# Altium schematic sheet MCU.SchDoc
size 406 x 304 mm; SheetNumber: 11; SheetTotal: 14
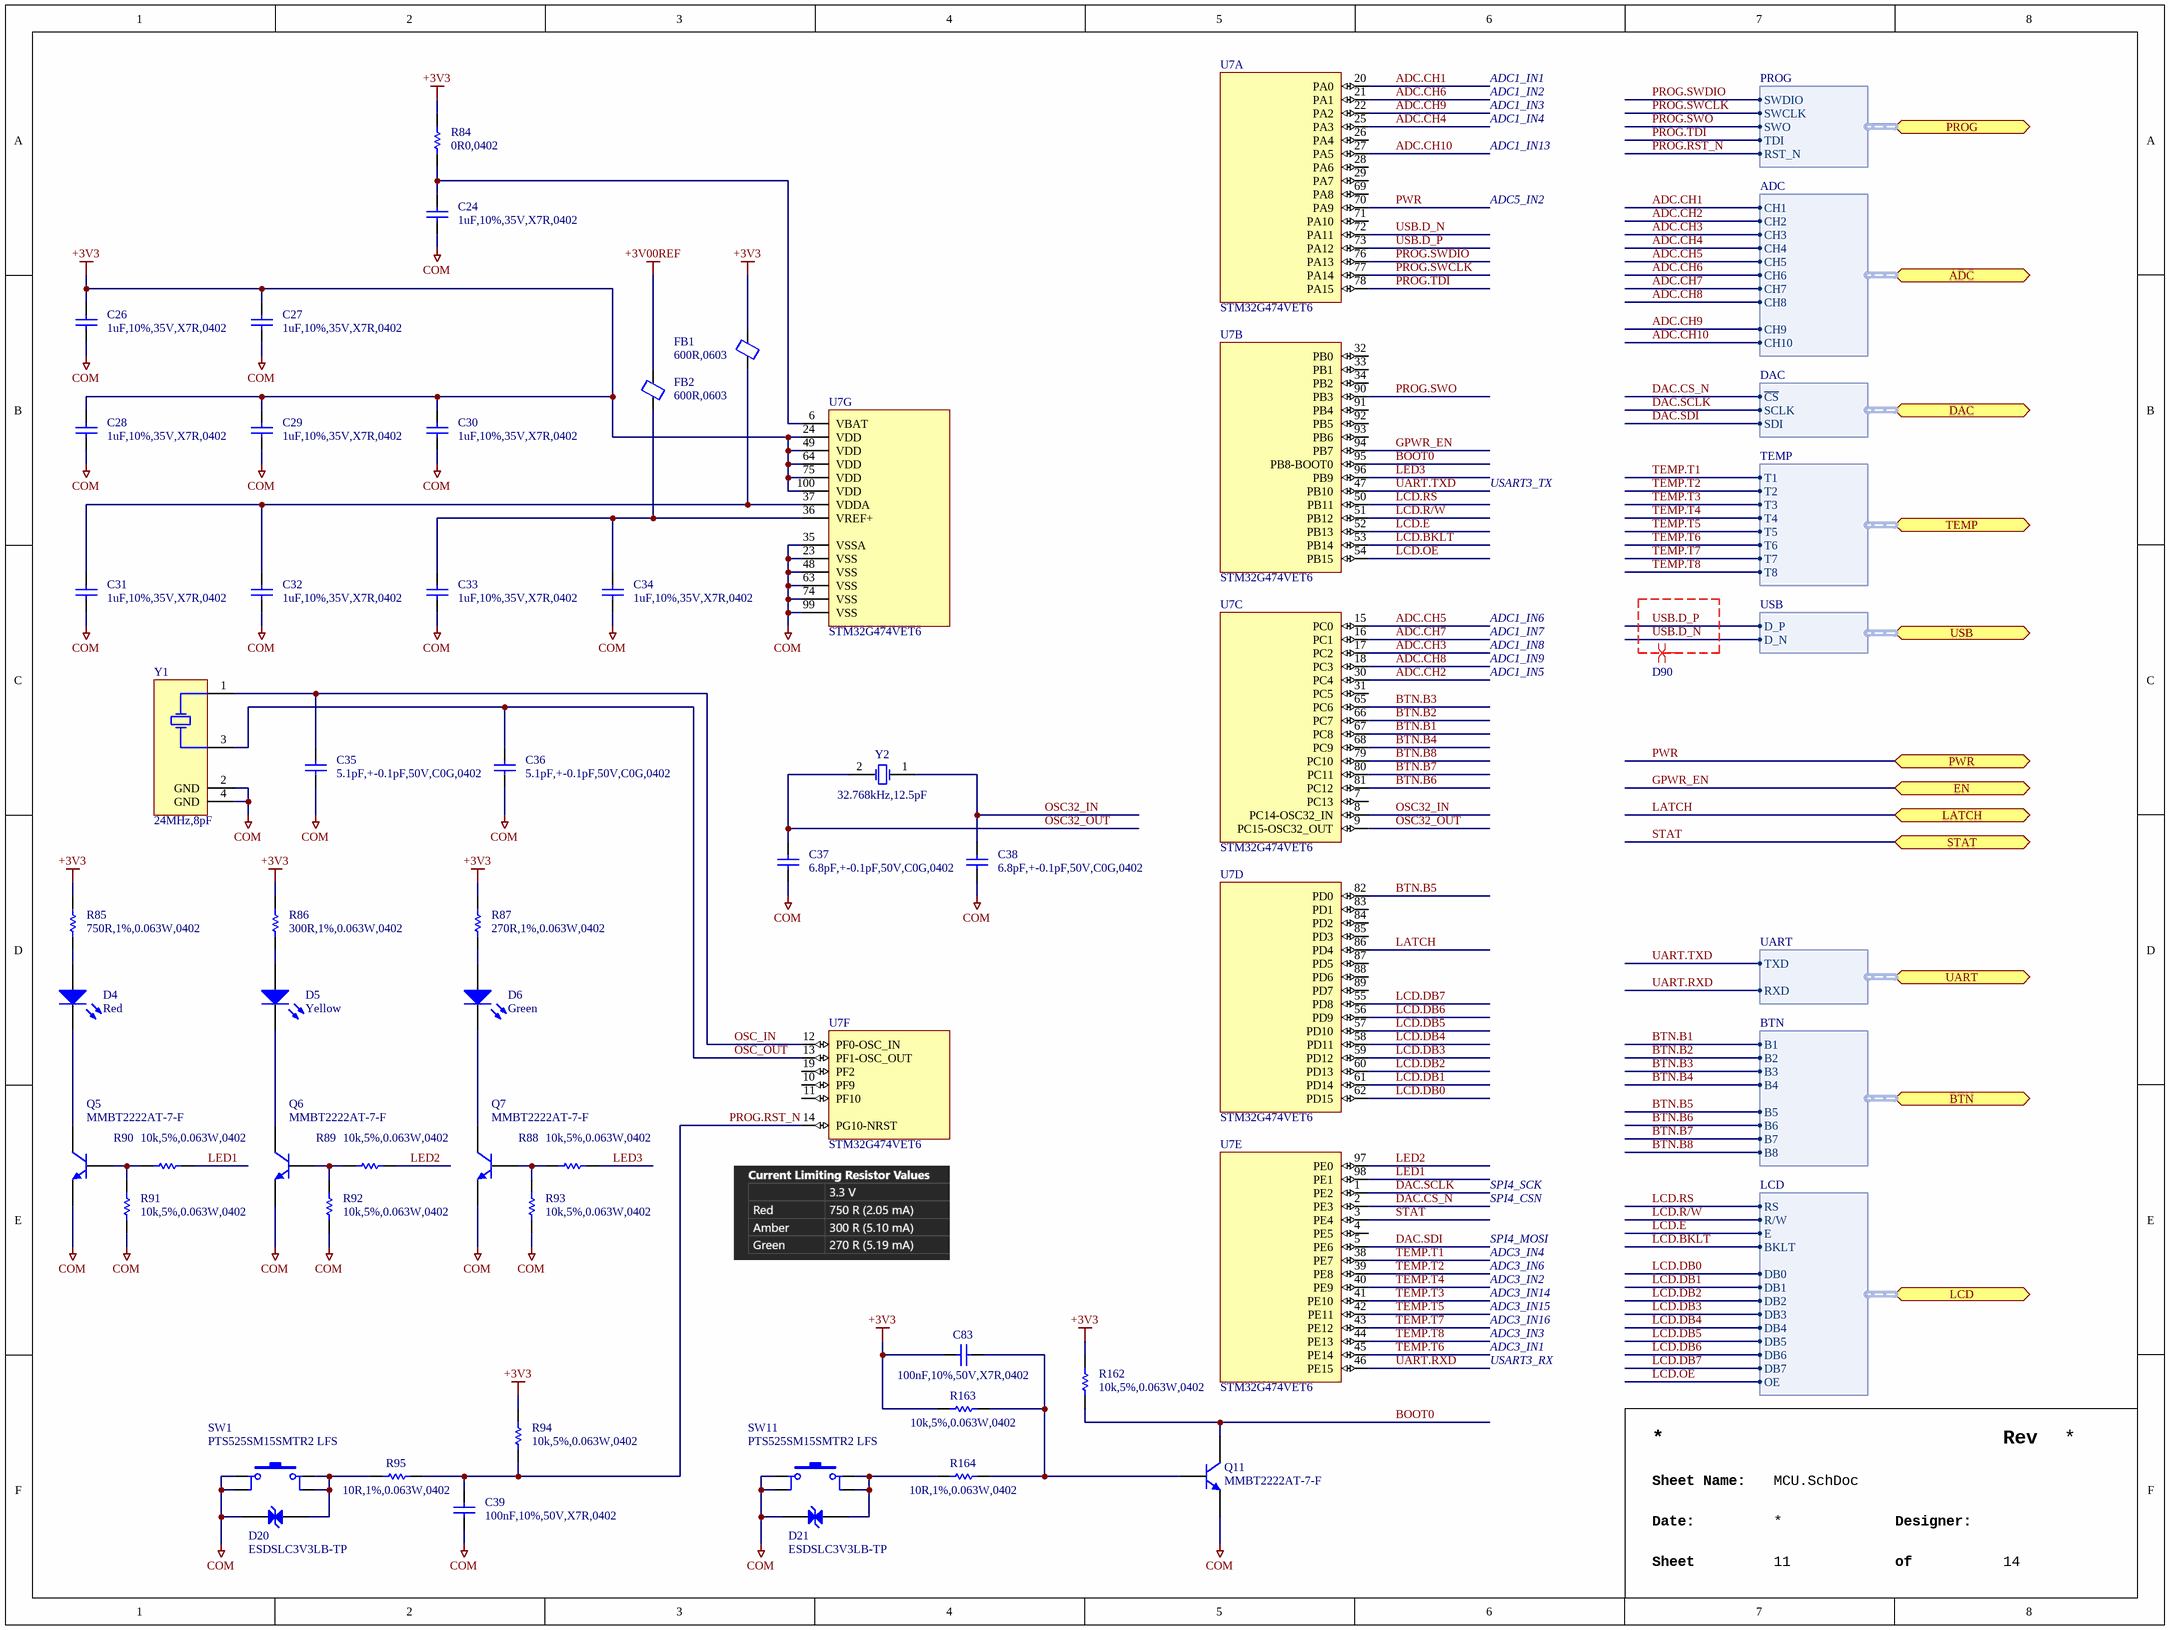
[diagram p0: MCU.SchDoc]

## Parts
C24  1uF,10%,35V,X7R,0402  [CAPC1005X06N]
C26  1uF,10%,35V,X7R,0402  [CAPC1005X06N]
C27  1uF,10%,35V,X7R,0402  [CAPC1005X06N]
C28  1uF,10%,35V,X7R,0402  [CAPC1005X06N]
C29  1uF,10%,35V,X7R,0402  [CAPC1005X06N]
C30  1uF,10%,35V,X7R,0402  [CAPC1005X06N]
C31  1uF,10%,35V,X7R,0402  [CAPC1005X06N]
C32  1uF,10%,35V,X7R,0402  [CAPC1005X06N]
C33  1uF,10%,35V,X7R,0402  [CAPC1005X06N]
C34  1uF,10%,35V,X7R,0402  [CAPC1005X06N]
C35  5.1pF,+-0.1pF,50V,C0G,0402  [CAPC1005X06N]
C36  5.1pF,+-0.1pF,50V,C0G,0402  [CAPC1005X06N]
C37  6.8pF,+-0.1pF,50V,C0G,0402  [CAPC1005X06N]
C38  6.8pF,+-0.1pF,50V,C0G,0402  [CAPC1005X06N]
C39  100nF,10%,50V,X7R,0402  [CAPC1005X06N]
C83  100nF,10%,50V,X7R,0402  [CAPC1005X06N]
D4  Red  [LITE-ON_LTST-C190KRKT]
D5  Yellow  [LITE-ON_LTST-C190KSKT]
D6  Green  [LITE-ON_LTST-C190KGKT]
D20  ESDSLC3V3LB-TP  [DFN65P100X50-2N]
D21  ESDSLC3V3LB-TP  [DFN65P100X50-2N]
FB1  600R,0603  [INDC_0603]
FB2  600R,0603  [INDC_0603]
Q5  MMBT2222AT-7-F  [SOTFL50P160X90-3N]
Q6  MMBT2222AT-7-F  [SOTFL50P160X90-3N]
Q7  MMBT2222AT-7-F  [SOTFL50P160X90-3N]
Q11  MMBT2222AT-7-F  [SOTFL50P160X90-3N]
R84  0R0,0402  [RESC1005X04N]
R85  750R,1%,0.063W,0402  [RESC1005X04N]
R86  300R,1%,0.063W,0402  [RESC1005X04N]
R87  270R,1%,0.063W,0402  [RESC1005X04N]
R88  10k,5%,0.063W,0402  [RESC1005X04N]
R89  10k,5%,0.063W,0402  [RESC1005X04N]
R90  10k,5%,0.063W,0402  [RESC1005X04N]
R91  10k,5%,0.063W,0402  [RESC1005X04N]
R92  10k,5%,0.063W,0402  [RESC1005X04N]
R93  10k,5%,0.063W,0402  [RESC1005X04N]
R94  10k,5%,0.063W,0402  [RESC1005X04N]
R95  10R,1%,0.063W,0402  [RESC1005X04N]
R162  10k,5%,0.063W,0402  [RESC1005X04N]
R163  10k,5%,0.063W,0402  [RESC1005X04N]
R164  10R,1%,0.063W,0402  [RESC1005X04N]
SW1  PTS525SM15SMTR2 LFS  [C&K_PTS525SM15SMTR2 LFS]
SW11  PTS525SM15SMTR2 LFS  [C&K_PTS525SM15SMTR2 LFS]
U7  STM32G474VET6  [STMICROELECTRONICS_PKG_LQFP100]  (parts A,B,C,D,E,F,G of 7)
Y1  24MHz,8pF  [NDK_NX2016SA]
Y2  32.768kHz,12.5pF  [EPSON_FC-135]

## Ports
ADC (bidir, harness ADC), BTN (bidir, harness BTN), DAC (bidir, harness DAC), EN (bidir), LATCH (bidir), LCD (bidir, harness LCD), PROG (bidir, harness PROG), PWR (bidir), STAT (bidir), TEMP (bidir, harness TEMP), UART (bidir, harness UART), USB (bidir, harness USB)

## Harnesses
ADC: CH10, CH1, CH2, CH3, CH4, CH5, CH6, CH7, CH8, CH9
DAC: SDI, SCLK, ~{CS}
TEMP: T1, T2, T3, T4, T5, T6, T7, T8
USB: D_P, D_N
LCD: RS, R/W, E, BKLT, DB0, DB1, DB2, DB3, DB4, DB5, DB6, DB7, OE
BTN: B1, B2, B3, B4, B5, B6, B7, B8
UART: TXD, RXD
PROG: SWDIO, SWCLK, SWO, TDI, RST_N

## Nets
+3V00REF: FB2.2
+3V3: C26.2 C27.2 C28.2 C29.2 C30.2 C83.2 FB1.2 R84.2 R85.2 R86.2 R87.2 R94.2 R162.1 R163.2 U7.24(VDD) U7.49(VDD) U7.64(VDD) U7.75(VDD) U7.100(VDD)
COM: C24.1 C26.1 C27.1 C28.1 C29.1 C30.1 C31.1 C32.1 C33.1 C34.1 C35.1 C36.1 C37.1 C38.1 C39.1 D20.1(K) D21.1(K) Q5.2(E) Q6.2(E) Q7.2(E) Q11.2(E) R91.1 R92.1 R93.1 SW1.1 SW1.2 SW11.1 SW11.2 U7.23(VSS) U7.35(VSSA) U7.48(VSS) U7.63(VSS) U7.74(VSS) U7.99(VSS) Y1.2(GND) Y1.4(GND)
ADC.CH1: U7.20(PA0) ; port ADC.CH1
ADC.CH2: U7.30(PC4) ; port ADC.CH2
ADC.CH3: U7.17(PC2) ; port ADC.CH3
ADC.CH4: U7.25(PA3) ; port ADC.CH4
ADC.CH5: U7.15(PC0) ; port ADC.CH5
ADC.CH6: U7.21(PA1) ; port ADC.CH6
ADC.CH7: U7.16(PC1) ; port ADC.CH7
ADC.CH8: U7.18(PC3) ; port ADC.CH8
ADC.CH9: U7.22(PA2) ; port ADC.CH9
ADC.CH10: U7.27(PA5) ; port ADC.CH10
BOOT0: Q11.3(C) R162.2 U7.95(PB8-BOOT0)
BTN.B1: U7.67(PC8) ; port BTN.B1
BTN.B2: U7.66(PC7) ; port BTN.B2
BTN.B3: U7.65(PC6) ; port BTN.B3
BTN.B4: U7.68(PC9) ; port BTN.B4
BTN.B5: U7.82(PD0) ; port BTN.B5
BTN.B6: U7.81(PC12) ; port BTN.B6
BTN.B7: U7.80(PC11) ; port BTN.B7
BTN.B8: U7.79(PC10) ; port BTN.B8
DAC.CS_N: U7.2(PE3) ; port DAC.~{CS}
DAC.SCLK: U7.1(PE2) ; port DAC.SCLK
DAC.SDI: U7.5(PE6) ; port DAC.SDI
GPWR_EN: U7.94(PB7) ; port EN
LATCH: U7.86(PD4) ; port LATCH
LCD.BKLT: U7.53(PB14) ; port LCD.BKLT
LCD.DB0: U7.62(PD15) ; port LCD.DB0
LCD.DB1: U7.61(PD14) ; port LCD.DB1
LCD.DB2: U7.60(PD13) ; port LCD.DB2
LCD.DB3: U7.59(PD12) ; port LCD.DB3
LCD.DB4: U7.58(PD11) ; port LCD.DB4
LCD.DB5: U7.57(PD10) ; port LCD.DB5
LCD.DB6: U7.56(PD9) ; port LCD.DB6
LCD.DB7: U7.55(PD8) ; port LCD.DB7
LCD.E: U7.52(PB13) ; port LCD.E
LCD.OE: U7.54(PB15) ; port LCD.OE
LCD.R/W: U7.51(PB12) ; port LCD.R/W
LCD.RS: U7.50(PB11) ; port LCD.RS
LED1: R90.1 U7.98(PE1)
LED2: R89.1 U7.97(PE0)
LED3: R88.1 U7.96(PB9)
OSC32_IN: C38.2 U7.8(PC14-OSC32_IN) Y2.1(OSC1)
OSC32_OUT: C37.2 U7.9(PC15-OSC32_OUT) Y2.2(GND)
OSC_IN: C35.2 U7.12(PF0-OSC_IN) Y1.1(OSC1)
OSC_OUT: C36.2 U7.13(PF1-OSC_OUT) Y1.3(OSC2)
PROG.RST_N: C39.2 R94.1 R95.2 U7.14(PG10-NRST) ; port PROG.RST_N
PROG.SWCLK: U7.77(PA14) ; port PROG.SWCLK
PROG.SWDIO: U7.76(PA13) ; port PROG.SWDIO
PROG.SWO: U7.90(PB3) ; port PROG.SWO
PROG.TDI: U7.78(PA15) ; port PROG.TDI
PWR: U7.70(PA9) ; port PWR
STAT: U7.3(PE4) ; port STAT
TEMP.T1: U7.38(PE7) ; port TEMP.T1
TEMP.T2: U7.39(PE8) ; port TEMP.T2
TEMP.T3: U7.41(PE10) ; port TEMP.T3
TEMP.T4: U7.40(PE9) ; port TEMP.T4
TEMP.T5: U7.42(PE11) ; port TEMP.T5
TEMP.T6: U7.45(PE14) ; port TEMP.T6
TEMP.T7: U7.43(PE12) ; port TEMP.T7
TEMP.T8: U7.44(PE13) ; port TEMP.T8
UART.RXD: U7.46(PE15) ; port UART.RXD
UART.TXD: U7.47(PB10) ; port UART.TXD
USB.D_N: U7.72(PA11) ; port USB.D_N
USB.D_P: U7.73(PA12) ; port USB.D_P
NetC24_2: C24.2 R84.1 U7.6(VBAT)
NetC31_2: C31.2 C32.2 FB1.1 U7.37(VDDA)
NetC33_2: C33.2 C34.2 FB2.1 U7.36(VREF+)
NetC83_1: C83.1 Q11.1(B) R163.1 R164.2
NetD4_A: D4.A R85.1
NetD4_C: D4.C Q5.3(C)
NetD5_A: D5.A R86.1
NetD5_C: D5.C Q6.3(C)
NetD6_A: D6.A R87.1
NetD6_C: D6.C Q7.3(C)
NetD20_2: D20.2(A) R95.1 SW1.3 SW1.4
NetD21_2: D21.2(A) R164.1 SW11.3 SW11.4
NetQ5_1: Q5.1(B) R90.2 R91.2
NetQ6_1: Q6.1(B) R89.2 R92.2
NetQ7_1: Q7.1(B) R88.2 R93.2

Not connected (* = marked no-connect by the designer): U7 4(PE5) 7(PC13) 10(PF9) 11(PF10) 19(PF2) 26(PA4) 28(PA6) 29(PA7) 31(PC5) 32(PB0) 33(PB1) 34(PB2) 69(PA8) 71(PA10) 83(PD1) 84(PD2) 85(PD3) 87(PD5) 88(PD6) 89(PD7) 91(PB4) 92(PB5) 93(PB6)

## Layout directives
differential pair; differential pair class D90: USB.D_N, USB.D_P

## Notes on the sheet
- ADC1_IN1
- ADC1_IN2
- ADC1_IN3
- ADC1_IN4
- ADC1_IN13
- ADC5_IN2
- USART3_TX
- ADC1_IN6
- ADC1_IN7
- ADC1_IN5
- ADC1_IN8
- ADC1_IN9
- SPI4_SCK
- SPI4_CSN
- SPI4_MOSI
- ADC3_IN4
- ADC3_IN6
- ADC3_IN2
- ADC3_IN14
- ADC3_IN15
- ADC3_IN16
- ADC3_IN3
- ADC3_IN1
- USART3_RX
- Rev
- Sheet Name:
- Date:
- Sheet
- Designer:
- of

## Library data of the parts
C24 C26-C34 = CAP,Cer,1uF,35VDC,X5R,0402: 1 ï¿½F ï¿½10% 35V Ceramic Capacitor X5R 0402 (1005 Metric); Manufacturer 1: TDK Corporation; Manufacturer 1 Part Number: C1005X5R1V105K050BC; Vendor 1 Part Number: 445-9073-1-ND; Vendor 1: Digikey; Value: 1u; Part Name: CAP,Cer,1uF,35VDC,X5R,0402; CreatedBy: Judd Foster; HelpURL: https://product.tdk.com/info/en/catalog/datasheets/mlcc_commercial_general_en.pdf?ref_disty=digikey
C35 C36 = CAP,Cer,5.1pF,+-0.1pF,50V,C0G,0402: 50V 5.1pF C0G 0402 Ceramic Capacitors ROHS; Manufacturer 1: Murata; Manufacturer 1 Part Number: GJM1555C1H5R1BB01D; Vendor 1 Part Number: C237535; Vendor 1: LCSC; Value: 5.1p; Part Name: CAP,Cer,5.1pF,+-0.1pF,50V,C0G,0402; CreatedBy: Judd Foster; HelpURL: https://www.lcsc.com/datasheet/C237535.pdf
C37 C38 = CAP,Cer,6.8pF,+-0.1pF,50V,C0G,0402: 50V 6.8pF C0G 0402 Ceramic Capacitors ROHS; Manufacturer 1: Murata; Manufacturer 1 Part Number: GJM1555C1H6R8BB01D; Vendor 1 Part Number: C88896; Vendor 1: LCSC; Value: 6.8p; Part Name: CAP,Cer,6.8pF,+-0.1pF,50V,C0G,0402; CreatedBy: Judd Foster; HelpURL: https://www.lcsc.com/datasheet/C88896.pdf
C39 C83 = CAP,Cer,100nF,10%,50V,X7R,0402: 50V 100nF X7R Â±10% 0402 Ceramic Capacitors ROHS; Manufacturer 1: Murata; Manufacturer 1 Part Number: GRM155R71H104KE14D; Vendor 1 Part Number: C77020; Vendor 1: LCSC; Value: 100n; Part Name: CAP,Cer,100nF,10%,50V,X7R,0402; CreatedBy: Judd Foster; HelpURL: https://www.lcsc.com/datasheet/C77020.pdf
D4 = LED,Red,SMD,0603: Red 631nm LED Indication - Discrete 2V 0603 (1608 Metric); Manufacturer 1: Lite-On Inc.; Manufacturer 1 Part Number: LTST-C190KRKT; Vendor 1 Part Number: 160-1436-1-ND; Vendor 1: Digikey; Part Name: LED,Red,SMD,0603; CreatedBy: Judd Foster; HelpURL: https://optoelectronics.liteon.com/upload/download/DS-22-99-0151/LTST-C190KRKT.pdf; Value: Red
D5 = LED,Yellow,SMD,0603: Yellow 591nm LED Indication - Discrete 2.1V 0603 (1608 Metric); Manufacturer 1: Lite-On Inc.; Manufacturer 1 Part Number: LTST-C190KSKT; Vendor 1 Part Number: 160-1437-1-ND; Vendor 1: Digikey; Part Name: LED,Yellow,SMD,0603; CreatedBy: Judd Foster; HelpURL: https://optoelectronics.liteon.com/upload/download/DS-22-99-0189/LTST-C190KSKT.pdf; Value: Yellow
D6 = LED,Green,SMD,0603: Green 571nm LED Indication - Discrete 2V 0603 (1608 Metric); Manufacturer 1: Lite-On Inc.; Manufacturer 1 Part Number: LTST-C190KGKT; Vendor 1 Part Number: 160-1435-1-ND; Vendor 1: Digikey; Part Name: LED,Green,SMD,0603; CreatedBy: Judd Foster; HelpURL: https://optoelectronics.liteon.com/upload/download/DS22-2000-074/LTST-C190KGKT.PDF; Value: Green
D20 D21 = DIODE,TVS,3.3V,SOD882: 20V Clamp 5A (8/20ï¿½s) Ipp Tvs Diode Surface Mount DFN1006-2; Manufacturer 1: Micro Commercial Co; Vendor 1 Part Number: ESDSLC3V3LB-TPMSCT-ND; Vendor 1: Digikey; Part Name: DIODE,TVS,3.3V,SOD882; CreatedBy: Judd Foster; HelpURL: https://www.mccsemi.com/pdf/Products/ESDSLC3V3LB(DFN1006-2).pdf; Manufacturer 1 Part Number: ESDSLC3V3LB-TP
FB1 FB2 = FERRITE,600R@100MHz,350mA,0603: 500mÎ© Â±25% 600Î©@100MHz 0603 Ferrite Beads and Chips ROHS; Manufacturer 1: TAI-TECH; Manufacturer 1 Part Number: FCM1608KF-601T03; Vendor 1 Part Number: C141723; Vendor 1: LCSC; Part Name: FERRITE,600R@100MHz,350mA,0603; CreatedBy: Judd Foster; HelpURL: https://www.lcsc.com/datasheet/C141723.pdf
Q5-Q7 Q11 = Trans,NPN,40V,600mA,SOT523: Bipolar (BJT) Transistor NPN 40 V 600 mA 300MHz 150 mW Surface Mount SOT-523; Manufacturer 1: Diodes Incorporated; Vendor 1 Part Number: MMBT2222AT-FDICT-ND; Vendor 1: Digikey; Part Name: Trans,NPN,40V,600mA,SOT523; CreatedBy: Judd Foster; HelpURL: https://media.digikey.com/pdf/Data%20Sheets/Diodes%20PDFs/MMBT2222AT_Rev2016.pdf; Manufacturer 1 Part Number: MMBT2222AT-7-F
R84 = RES,0R0,0402: 0 Ohms Jumper 0.1W, 1/10W Chip Resistor 0402 (1005 Metric) Automotive AEC-Q200 Thick Film; Manufacturer 1: Panasonic Electronic Components; Manufacturer 1 Part Number: ERJ-2GE0R00X; Vendor 1 Part Number: P0.0JCT-ND; Vendor 1: Digikey; Value: 0; Part Name: RES,0R0,0402; CreatedBy: Judd Foster; HelpURL: https://industrial.panasonic.com/cdbs/www-data/pdf/RDA0000/AOA0000C301.pdf
R85 = RES,750R,1%,0.063W,0402: 750Î© 62.5mW 50V Â±100ppm/â„ƒ Thick Film Resistor Â±1% 0402 Chip Resistor - Surface Mount ROHS; Manufacturer 1: UNI-ROYAL; Manufacturer 1 Part Number: 0402WGF7500TCE; Vendor 1 Part Number: C25132; Vendor 1: LCSC; Part Name: RES,750R,1%,0.063W,0402; CreatedBy: Judd Foster; HelpURL: https://www.lcsc.com/datasheet/C25132.pdf
R86 = RES,300R,1%,0.063W,0402: 300Î© 62.5mW 50V Â±100ppm/â„ƒ Thick Film Resistor Â±1% 0402 Chip Resistor - Surface Mount ROHS; Manufacturer 1: UNI-ROYAL; Manufacturer 1 Part Number: 0402WGF3000TCE; Vendor 1 Part Number: C25102; Vendor 1: LCSC; Part Name: RES,300R,1%,0.063W,0402; CreatedBy: Judd Foster; HelpURL: https://www.lcsc.com/datasheet/C25102.pdf
R87 = RES,270R,1%,0.063W,0402: 62.5mW Thick Film Resistor 50V Â±100ppm/â„ƒ Â±1% 270Î© 0402 Chip Resistor - Surface Mount ROHS; Manufacturer 1: YAGEO; Manufacturer 1 Part Number: RC0402FR-07270RL; Vendor 1 Part Number: C163474; Vendor 1: LCSC; Value: 270; Part Name: RES,270R,1%,0.063W,0402; CreatedBy: Judd Foster; HelpURL: https://www.lcsc.com/datasheet/C163474.pdf
R88-R94 R162 R163 = RES,10k,5%,0.063W,0402: 10 kOhms ï¿½5% 0.063W, 1/16W Chip Resistor 0402 (1005 Metric) Automotive AEC-Q200 Thick Film; Manufacturer 1: Stackpole Electronics Inc; Manufacturer 1 Part Number: RMCF0402JT10K0; Vendor 1 Part Number: RMCF0402JT10K0CT-ND; Vendor 1: DIgikey; Part Name: RES,10k,5%,0.063W,0402; CreatedBy: Judd Foster; HelpURL: https://www.seielect.com/catalog/sei-rmcf_rmcp.pdf; Value: 10k
R95 R164 = RES,10R,1%,0.063W,0402: 10 Ohms ï¿½1% 0.063W, 1/16W Chip Resistor 0402 (1005 Metric) Automotive AEC-Q200 Thick Film; Manufacturer 1: Panasonic Electronic Components; Manufacturer 1 Part Number: ERJ-2RKF10R0X; Vendor 1 Part Number: P10.0LCT-ND; Vendor 1: Digikey; Value: 10; Part Name: RES,10R,1%,0.063W,0402; CreatedBy: Judd Foster; HelpURL: https://industrial.panasonic.com/cdbs/www-data/pdf/RDA0000/AOA0000C304.pdf
SW1 SW11 = Switch,Tactile,SPST-NO,SMD,H1.5: Tactile Switch SPST-NO Top Actuated Surface Mount; Manufacturer 1: C&K; Vendor 1 Part Number: CKN9104CT-ND; Vendor 1: Digikey; Part Name: Switch,Tactile,SPST-NO,SMD,H1.5; CreatedBy: Judd Foster; HelpURL: https://www.ckswitches.com/media/1467/pts525.pdf; Manufacturer 1 Part Number: PTS525SM15SMTR2 LFS
U7 = STM32G474VET6: ARM Cortex-M Series 170MHz 86 LQFP-100(14x14) Microcontrollers ROHS; Manufacturer 1: ST Microelectronics; Vendor 1 Part Number: C431632; Vendor 1: LCSC; Part Name: STM32G474VET6; CreatedBy: Judd Foster; HelpURL: https://www.st.com/en/microcontrollers-microprocessors/stm32g474ve.html; Manufacturer 1 Part Number: STM32G474VET6
Y1 = XTAL,24MHz,8pF,SMD: SMD2016-4P Crystals ROHS; Manufacturer 1: NDK; Manufacturer 1 Part Number: NX2016SA-24MHZ-STD-CZS-2; Vendor 1 Part Number: C843257; Vendor 1: LCSC; Part Name: XTAL,24MHz,8pF,SMD; CreatedBy: Judd Foster; HelpURL: https://www.lcsc.com/datasheet/C843257.pdf
Y2 = XTAL,32.768kHz,12.5pF,SMD: Crystal Oscillator 12.5pF SMD3215-2P Crystals ROHS; Manufacturer 1: EPSON; Manufacturer 1 Part Number: Q13FC13500004; Vendor 1 Part Number: C32346; Vendor 1: LCSC; Part Name: XTAL,32.768kHz,12.5pF,SMD; CreatedBy: Judd Foster; HelpURL: https://www.lcsc.com/datasheet/C32346.pdf